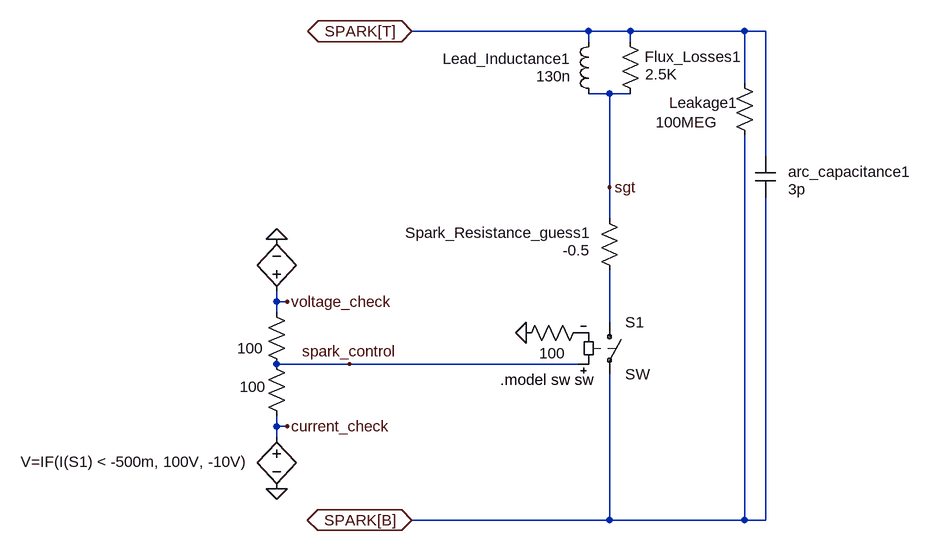
[diagram p0: schematic spark_gap.asc]
spark_gap.asc, the LTspice schematic file:
Version 4
SHEET 1 2128 820
WIRE 192 -144 -80 -144
WIRE 256 -144 192 -144
WIRE 432 -144 256 -144
WIRE 464 -144 432 -144
WIRE 192 -128 192 -144
WIRE 256 -128 256 -144
WIRE 432 -64 432 -144
WIRE 224 -48 192 -48
WIRE 256 -48 224 -48
WIRE 464 48 464 -144
WIRE 224 96 224 -48
WIRE 224 144 224 96
WIRE -288 272 -288 256
WIRE -272 272 -288 272
WIRE -288 288 -288 272
WIRE 224 304 224 224
WIRE -176 368 -288 368
WIRE 176 368 -176 368
WIRE -288 464 -288 448
WIRE -272 464 -288 464
WIRE -288 480 -288 464
WIRE 224 608 224 384
WIRE 224 608 -80 608
WIRE 432 608 432 16
WIRE 432 608 224 608
WIRE 464 608 464 112
WIRE 464 608 432 608
FLAG -80 -144 SPARK[T]
IOPIN -80 -144 BiDir
FLAG -80 608 SPARK[B]
IOPIN -80 608 BiDir
FLAG -288 176 0
FLAG -288 560 0
FLAG 96 320 0
FLAG -272 272 voltage_check
FLAG -272 464 current_check
FLAG -176 368 spark_control
FLAG 224 96 sgt
SYMBOL bv -288 464 R0
WINDOW 0 24 16 Invisible 2
WINDOW 3 -42 54 Right 2
SYMATTR InstName B1
SYMATTR Value V=IF(I(S1) < -500m, 100V, -10V)
SYMBOL bv -288 272 R180
WINDOW 0 24 96 Invisible 2
WINDOW 3 42 56 Left 2
SYMATTR InstName B2
SYMATTR Value ""
SYMBOL sw 224 288 R0
SYMATTR InstName S1
SYMBOL res 416 -80 R0
WINDOW 0 -100 46 Left 2
WINDOW 3 -121 76 Left 2
SYMATTR InstName Leakage1
SYMATTR Value 100MEG
SYMBOL res 240 -144 R0
WINDOW 0 38 39 Left 2
WINDOW 3 39 66 Left 2
SYMATTR InstName Flux_Losses1
SYMATTR Value 2.5K
SYMBOL res 208 128 R0
WINDOW 0 -11 38 Right 2
WINDOW 3 -14 65 Right 2
SYMATTR InstName Spark_Resistance_guess1
SYMATTR Value -0.5
SYMBOL ind 208 -32 R180
WINDOW 0 41 70 Left 2
WINDOW 3 43 43 Left 2
SYMATTR InstName Lead_Inductance1
SYMATTR Value 130n
SYMBOL cap 448 48 R0
WINDOW 0 51 24 Left 2
WINDOW 3 51 51 Left 2
SYMATTR InstName arc_capacitance1
SYMATTR Value 3p
SYMBOL res -272 384 R180
WINDOW 0 36 76 Invisible 2
WINDOW 3 36 40 Left 2
SYMATTR InstName R1
SYMATTR Value 100
SYMBOL res -304 352 R0
WINDOW 0 -34 43 Invisible 2
WINDOW 3 -41 51 Left 2
SYMATTR InstName R2
SYMATTR Value 100
SYMBOL res 80 336 R270
WINDOW 0 32 56 Invisible 2
WINDOW 3 0 56 VBottom 2
SYMATTR InstName R3
SYMATTR Value 100
TEXT 56 392 Left 2 !.model sw sw

The netlist it stands for:
* spark_gap.asc
B1 current_check 0 V=IF(I(S1) < -500m, 100V, -10V)
B2 voltage_check 0
S1 N001 SPARK[B] spark_control P001 SW
R§Leakage1 SPARK[T] SPARK[B] 100MEG
R§Flux_Losses1 SPARK[T] sgt 2.5K
R§Spark_Resistance_guess1 sgt N001 -0.5
Lead_Inductance1 sgt SPARK[T] 130n
C§arc_capacitance1 SPARK[T] SPARK[B] 3p
R1 spark_control voltage_check 100
R2 spark_control current_check 100
R3 0 P001 100
.model sw sw
.backanno
.end